# EAGLE design avr-usb-i2c (EAGLE 5.06)
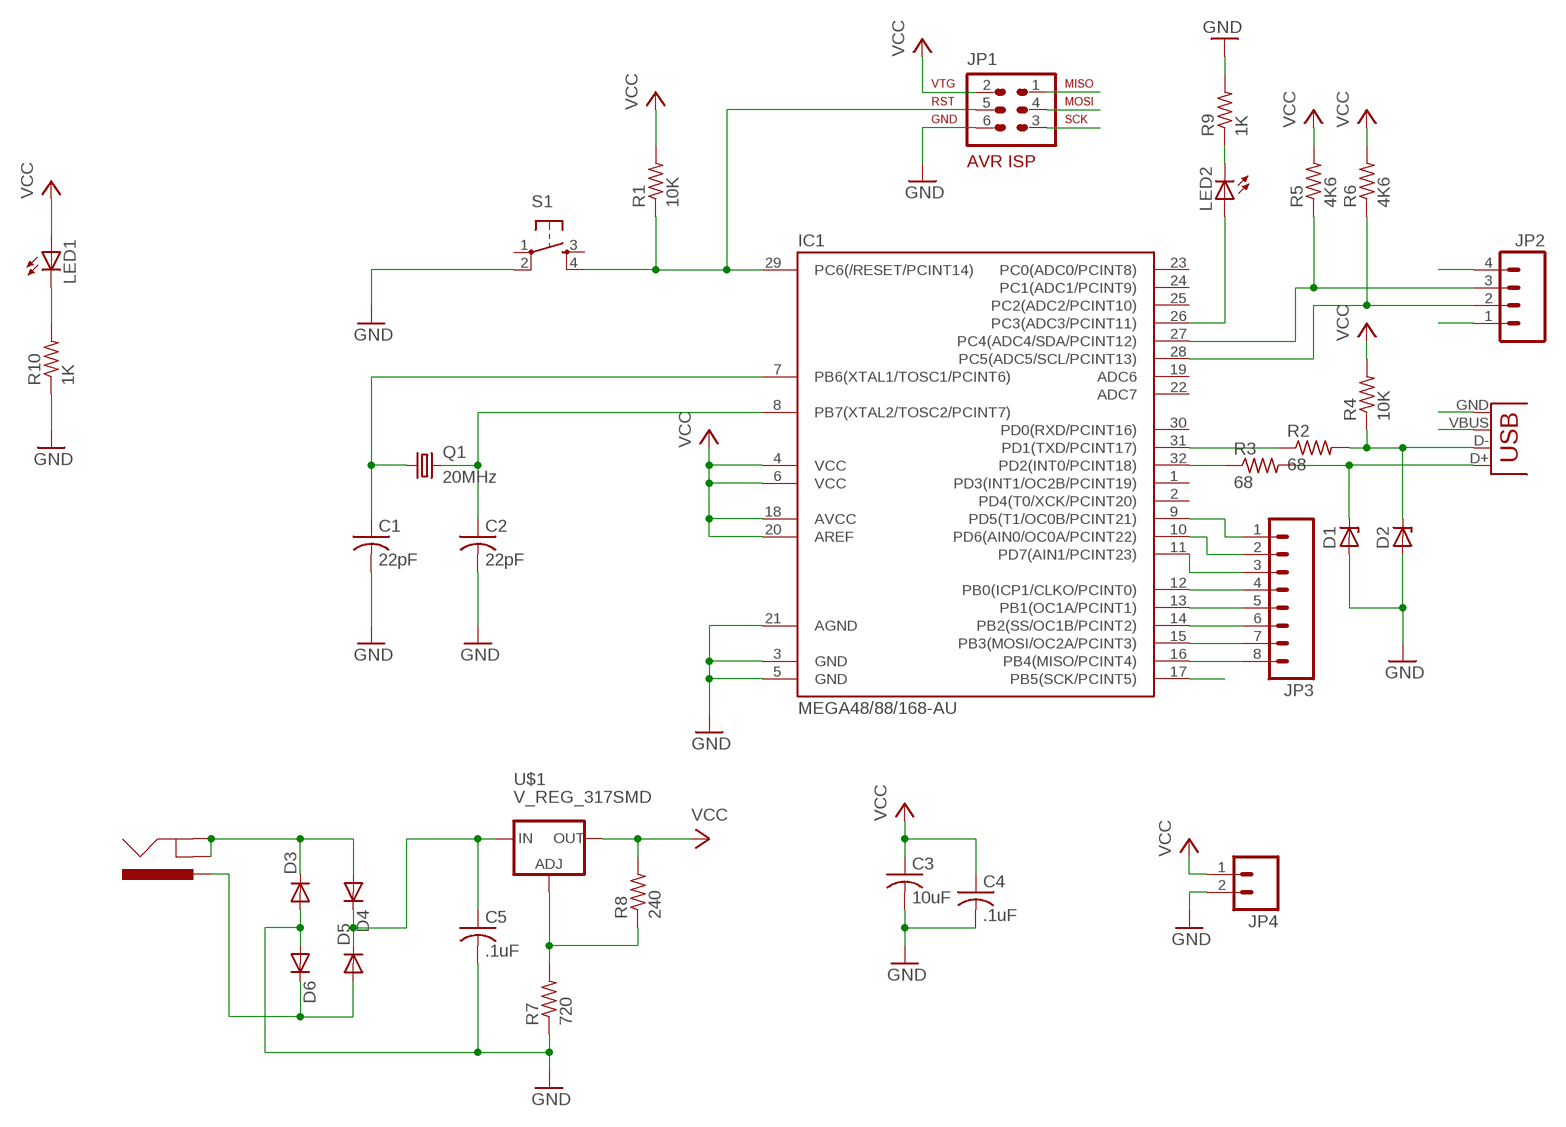
[diagram p0: schematic, sheet 1]

## Parts
C1  22pF  C-USC0805  [C0805]
C2  22pF  C-USC0805  [C0805]
C3  10uF  C-USC1206  [C1206]
C4  .1uF  C-USC0805  [C0805]
C5  .1uF  C-USC0805  [C0805]
D1  ZENER-DIODESOT23  [SOT23]
D2  ZENER-DIODESOT23  [SOT23]
D3  DIODESMA  [SMA-DIODE]
D4  DIODESMA  [SMA-DIODE]
D5  DIODESMA  [SMA-DIODE]
D6  DIODESMA  [SMA-DIODE]
IC1  MEGA48/88/168-AU  [TQFP32-08]
J1  POWER_JACKPTH  [POWER_JACK_PTH]
JP1  AVR-ISP-6  [AVR-ISP-6]
JP2  M04PTH  [1X04]
JP3  M08  [1X08]
JP4  M02PTH  [1X02]
LED1  LED1206  [LED-1206]
LED2  LED1206  [LED-1206]
Q1  20MHz  CRYSTAL5X3  [CRYSTAL-SMD-5X3]
R1  10K  R-US_M1206  [M1206]
R2  68  R-US_M1206  [M1206]
R3  68  R-US_M1206  [M1206]
R4  10K  R-US_M1206  [M1206]
R5  4K6  R-US_M1206  [M1206]
R6  4K6  R-US_M1206  [M1206]
R7  720  R-US_M1206  [M1206]
R8  240  R-US_M1206  [M1206]
R9  1K  R-US_M1206  [M1206]
R10  1K  R-US_M1206  [M1206]
S1  TAC_SWITCHPTH  [TACTILE-PTH]
U$1  V_REG_317SMD  [SOT223]
X1  USBSMD  [USB-MINIB]

## Nets
GND [GND]: C1.2 C2.2 C3.2 C4.2 C5.2 D1.1(A) D2.1(A) D3.A D6.A IC1.3(GND) IC1.5(GND) IC1.21(AGND) JP1.6 JP2.4 JP4.2 R7.1 R9.2 R10.1 S1.2 X1.GND
MISO: IC1.16(PB4(MISO/PCINT4)) JP1.1 JP3.8
MOSI: IC1.15(PB3(MOSI/OC2A/PCINT3)) JP1.4 JP3.7
N$1: C1.1 IC1.7(PB6(XTAL1/TOSC1/PCINT6)) Q1.1
N$2: C2.1 IC1.8(PB7(XTAL2/TOSC2/PCINT7)) Q1.3
N$3: IC1.29(PC6(/RESET/PCINT14)) JP1.5 R1.1 S1.4
N$4: IC1.31(PD1(TXD/PCINT17)) R2.1
N$5: IC1.32(PD2(INT0/PCINT18)) R3.1
N$6: IC1.27(PC4(ADC4/SDA/PCINT12)) JP2.3 R5.1
N$7: IC1.28(PC5(ADC5/SCL/PCINT13)) JP2.2 R6.1
N$8: IC1.26(PC3(ADC3/PCINT11)) LED2.A
N$9: LED2.C R9.1
N$10: D1.3(C) R3.2 X1.D+
N$11: D2.3(C) R2.2 R4.1 X1.D-
N$12: R7.2 R8.1 U$1.1(ADJ)
N$13: LED1.C R10.2
N$14 [VCC]: D3.C D4.A J1.GND J1.GNDBREAK
N$15: C5.1 D4.C D5.C U$1.3(IN)
N$16 [GND]: D5.A D6.C J1.PWR
N$17: IC1.14(PB2(SS/OC1B/PCINT2)) JP3.6
N$18: IC1.12(PB0(ICP1/CLKO/PCINT0)) JP3.4
N$19: IC1.11(PD7(AIN1/PCINT23)) JP3.3
N$20: IC1.10(PD6(AIN0/OC0A/PCINT22)) JP3.2
N$21: IC1.9(PD5(T1/OC0B/PCINT21)) JP3.1
N$22: IC1.13(PB1(OC1A/PCINT1)) JP3.5
SCK: IC1.17(PB5(SCK/PCINT5)) JP1.3
VCC [VCC]: C3.1 C4.1 IC1.4(VCC) IC1.6(VCC) IC1.18(AVCC) IC1.20(AREF) JP1.2 JP2.1 JP4.1 LED1.A R1.2 R4.2 R5.2 R6.2 R8.2 U$1.2(OUT) X1.VBUS
Unconnected: IC1.1(PD3(INT1/OC2B/PCINT19)) IC1.2(PD4(T0/XCK/PCINT20)) IC1.19(ADC6) IC1.22(ADC7) IC1.23(PC0(ADC0/PCINT8)) IC1.24(PC1(ADC1/PCINT9)) IC1.25(PC2(ADC2/PCINT10)) IC1.30(PD0(RXD/PCINT16)) S1.1 S1.3

## Library data of the parts
C1-C5 = rcl:C-US: CAPACITOR, American symbol
D1 D2 = diode:ZENER-DIODE: Z-Diode
D3-D6 = SparkFun:DIODE: Diode These are standard reverse protection diodes and small signal diodes. SMA package can handle up to about 1A. SOD-323 can handle about 200mA. What the SOD-323 package when ordering, there are some mfgs out there that are 5-pin packages.
IC1 = avr-6:MEGA48/88/168
J1 = SparkFun:POWER_JACK: Power Jack This is the standard 5.5mm barrel jack for power. The PTH is the most common, proven, reliable, footprint. All others are experimental. The Slot footprint only works if the mill layer is transmitted to the PCB fab house so be warned. Spark Fun Electronics SKU : PRT-00119. Mating wall wart : TOL-00298 (and others)
JP1 = avr-6:AVR-ISP-6: AVR ISP-6 Serial Programming Header
JP2 = SparkFun:M04: Header 4 Standard 4-pin 0.1" header. Use with straight break away headers (SKU : PRT-00116), right angle break away headers (PRT-00553), swiss pins (PRT-00743), machine pins (PRT-00117), and female headers (PRT-00115). Molex polarized connector foot print use with SKU : PRT-08231 with associated crimp pins and housings.
JP3 = SparkFun:M08: Header 8 Standard 8-pin 0.1" header. Use with straight break away headers (SKU : PRT-00116), right angle break away headers (PRT-00553), swiss pins (PRT-00743), machine pins (PRT-00117), and female headers (PRT-00115).
JP4 = SparkFun:M02: Header 2 Standard 2-pin 0.1" header. Use with straight break away headers (SKU : PRT-00116), right angle break away headers (PRT-00553), swiss pins (PRT-00743), machine pins (PRT-00117), and female headers (PRT-00115). Molex polarized connector foot print use with SKU : PRT-08233 with associated crimp pins and housings.
LED1 LED2 = SparkFun:LED: LEDs Standard schematic elements and footprints for 5mm, 3mm, 1206, and 0603 sized LEDs. 5mm - Spark Fun Electronics SKU : COM-00529 (and others)
Q1 = SparkFun:CRYSTAL: Crystals Various standard crystals. Proven footprints. Spark Fun Electronics SKU : COM-00534
R1-R10 = rcl:R-US_: RESISTOR, American symbol
S1 = SparkFun:TAC_SWITCH: Momentary Switch Button commonly used for reset or general input. Spark Fun Electronics SKU : COM-00097
U$1 = SparkFun:V_REG_317: Voltage Regulator Standard LM317 adjustable voltage regulator. AOI (Adjust Output Input). Google 'LM317 Calculator' for easy to use app to get the two resistor values needed. 240/720 for 5V output. 240/390 for 3.3V output. Spark Fun Electronics SKU : COM-00527
X1 = SparkFun:USB: USB Connectors USB-B-PTH is fully proven SKU : PRT-00139 USB-miniB is fully proven SKU : PRT-00587 USB-A-PCB is untested. USB-A-H is throughly reviewed, but untested. Spark Fun Electronics SKU : PRT-00437 USB-B-SMT is throughly reviewed, but untested. Needs silkscreen touching up. USB-A-S has not been used/tested USB-MB-H has not been used/tested

## Net classes
1 VCC: width 0.305 mm
2 GND: width 0.305 mm

## Board
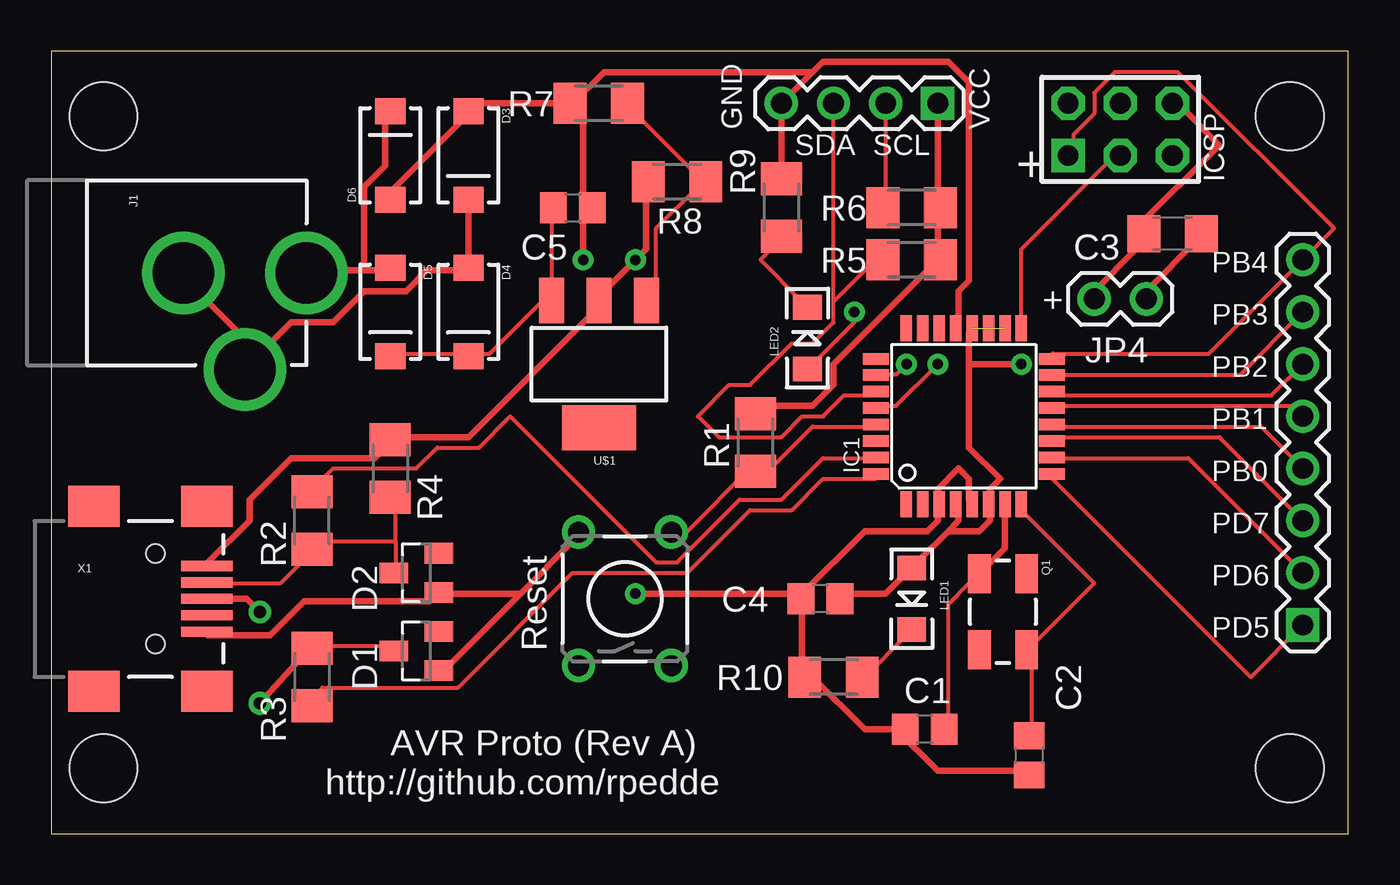
[diagram p1: board, top side]
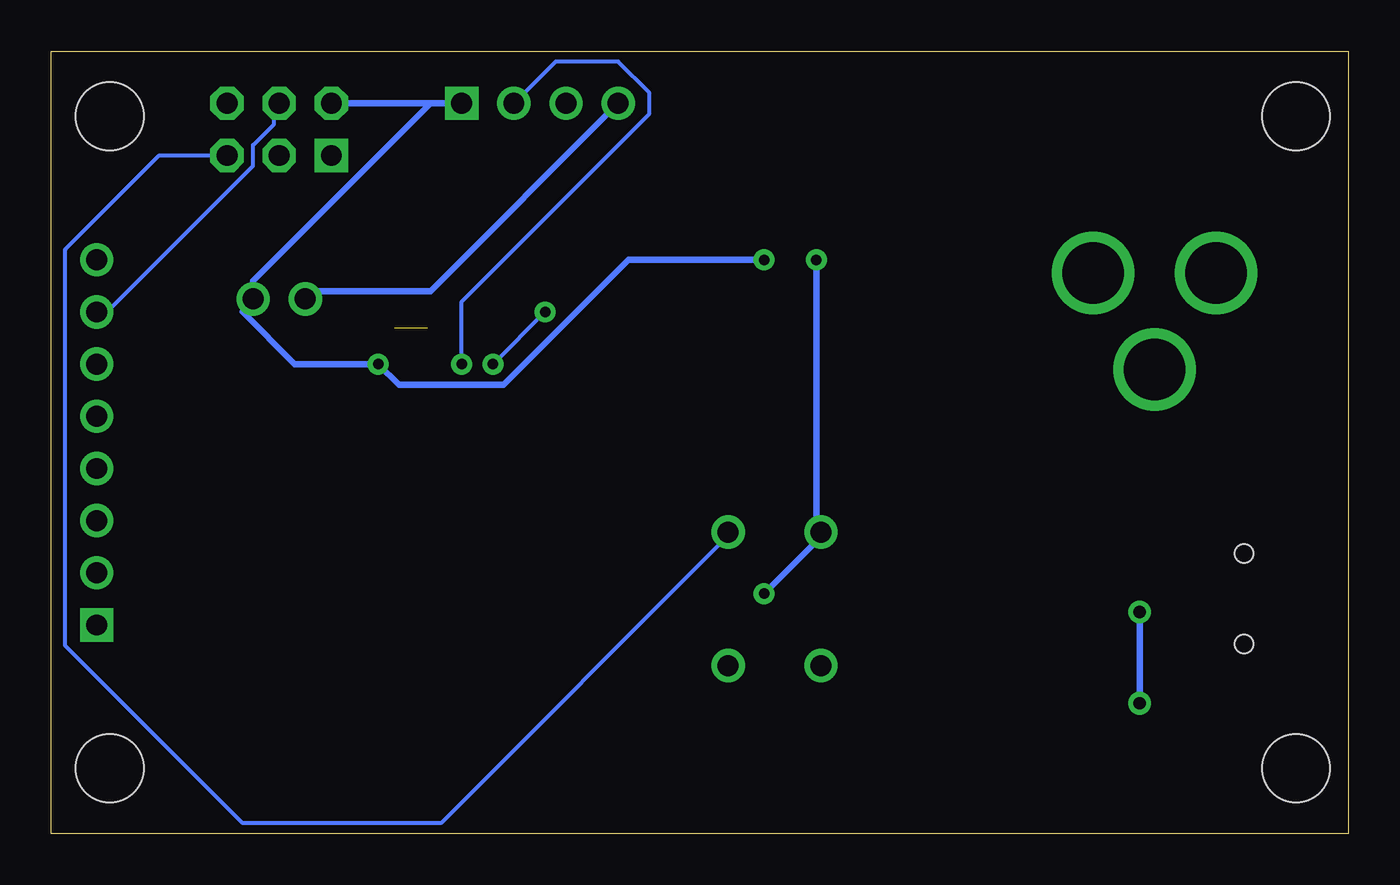
[diagram p2: board, bottom side, seen from below]

Size 63.17 x 38.09 mm. Coordinates in mm from the lower left corner, seen from the top.
Outline: 0,0 63.17,0 63.17,38.09 0,38.09 0,0
Copper layers (1*16): Top 0.035mm / dielectric 1.5mm / Bottom 0.035mm
Design rules "SparkFun": minimum track width 8mil, minimum drill 20mil, track to track 8mil, track to pad 8mil, pad to pad 8mil, via to via 8mil, smd to smd 8mil, copper to edge 10mil, drill to drill 8mil, minimum pad ring 12mil, minimum via ring 10mil, stop-mask expansion 4mil, vias tented up to drill 25mil, thermal gap 10mil

### Footprints (pad centres in the part's own frame; a part is rotated, then mirrored left to right if it is on the bottom)
C0805 = smd 1.3 x 1.5: 1 -0.95,0; 2 0.95,0
C1206 = smd 1.6 x 1.8: 1 -1.4,0; 2 1.4,0
SOT23 = smd 1 x 1.4: 1 -0.95,-1.1; 2 0.95,-1.1; 3 0,1.1
SMA-DIODE = smd 1.27 x 1.47: A -2.15,0; C 2.15,0
TQFP32-08 = smd 1.27 x 0.559: 1 -4.293,2.8; 2 -4.293,2; 3 -4.293,1.2; 4 -4.293,0.4; 5 -4.293,-0.4; 6 -4.293,-1.2; 7 -4.293,-2; 8 -4.293,-2.8; 17 4.293,-2.8; 18 4.293,-2; 19 4.293,-1.2; 20 4.293,-0.4; 21 4.293,0.4; 22 4.293,1.2; 23 4.293,2; 24 4.293,2.8 | smd 0.559 x 1.27: 9 -2.8,-4.293; 10 -2,-4.293; 11 -1.2,-4.293; 12 -0.4,-4.293; 13 0.4,-4.293; 14 1.2,-4.293; 15 2,-4.293; 16 2.8,-4.293; 25 2.8,4.293; 26 2,4.293; 27 1.2,4.293; 28 0.4,4.293; 29 -0.4,4.293; 30 -1.2,4.293; 31 -2,4.293; 32 -2.8,4.293
POWER_JACK_PTH = drill 2.997 round: GND 0,7.7; GNDBREAK 4.7,10.7; PWR 0,13.7
AVR-ISP-6 = drill 1.016 square: 1 -2.54,-1.27 | drill 1.016 octagon: 2 -2.54,1.27; 3 0,-1.27; 4 0,1.27; 5 2.54,-1.27; 6 2.54,1.27
1X04 = drill 1.016 square: 1 0,0 | drill 1.016 round: 2 2.54,0; 3 5.08,0; 4 7.62,0
1X08 = drill 1.016 square: 1 0,0 | drill 1.016 round: 2 2.54,0; 3 5.08,0; 4 7.62,0; 5 10.16,0; 6 12.7,0; 7 15.24,0; 8 17.78,0
1X02 = drill 1.016 round: 1 0,0; 2 2.54,0
LED-1206 = smd 1.2 x 1.4: A -1.5,0; C 1.5,0
CRYSTAL-SMD-5X3 = smd 1.9 x 1.1: 1 -1.85,-1.15; 2 1.85,-1.15; 3 1.85,1.15; 4 -1.85,1.15
M1206 = smd 1.6 x 2: 1 -1.4,0; 2 1.4,0
TACTILE-PTH = drill 1.016 round: 1 -3.251,2.261; 2 3.251,2.261; 3 -3.251,-2.261; 4 3.251,-2.261
SOT223 = smd 1.219 x 2.235: 1 -2.311,-3.099; 2 0,-3.099; 3 2.311,-3.099 | smd 3.6 x 2.2: 4 0,3.099
STAND-OFF = hole 3.302: 0,0
USB-MINIB = smd 2.5 x 0.5: D+ 2.5,0; D- 2.5,0.8; GND 2.5,-1.6; ID 2.5,-0.8; VBUS 2.5,1.6 | smd 2.5 x 2: GND@1 -3,-4.5; GND@2 -3,4.5; GND@3 2.5,4.5; GND@4 2.5,-4.5 | hole 0.9: 0,2.2; 0,-2.2

### Placement (x,y rotation side)
C1  42.55,5.08 180 top
C2  47.62,3.81 270 top
C3  54.61,29.21 180 top
C4  37.47,11.43 180 top
C5  25.4,30.48 0 top
D1  17.78,8.89 90 top
D2  17.78,12.7 90 top
D3  20.32,33.02 270 top
D4  20.32,25.4 270 top
D5  16.51,25.4 270 top
D6  16.51,33.02 90 top
IC1  44.45,20.32 90 top
J1  -1.27,27.3 270 top
JP1  52.07,34.29 0 top
JP2  43.18,35.56 180 top
JP3  60.96,10.16 90 top
JP4  53.34,26.04 180 top
LED1  41.91,11.43 270 top
LED2  36.83,24.13 90 top
Q1  46.35,10.79 270 top
R1  34.29,19.05 90 top
R2  12.7,15.24 270 top
R3  12.7,7.62 90 top
R4  16.51,17.78 90 top
R5  41.91,27.94 0 top
R6  41.91,30.48 0 top
R7  26.67,35.56 0 top
R8  30.48,31.75 180 top
R9  35.56,30.48 90 top
R10  38.1,7.62 0 top
S1  27.94,11.43 90 top
U$1  26.67,22.86 180 top
U$2  [STAND-OFF]  2.54,34.92 0 top
U$3  [STAND-OFF]  2.54,3.17 0 top
U$4  [STAND-OFF]  60.33,3.17 0 top
U$5  [STAND-OFF]  60.33,34.92 0 top
X1  5.08,11.43 0 top

### Tracks (layer width: path | path; a pad name or v marks a point on that pad's centre or on a via)
GND  (via drill 0.51)
  Top 0.305: JP4.2 50.8,26.42 52.83,28.45 52.83,28.96 C3.2 52.83,29.46 56.9,33.53 54.86,35.56 JP1.6 | 25.91,30.48 25.91,35.05 25.4,35.56 | D6.A 16.76,30.99 16.76,31.5 20.32,35.05 D3.A 20.32,35.56 R7.1 25.4,35.56 | 37.08,37.08 JP2.4 R9.2 | 37.08,37.08 37.59,37.59 43.69,37.59 44.7,36.58 44.7,26.92 44.2,26.42 44.2,24.89 IC1.21 | 25.4,35.56 26.92,37.08 37.08,37.08 | C4.2 36.58,11.68 39.62,14.73 42.67,14.73 43.18,15.24 43.18,15.75 IC1.3 43.18,16.26 43.18,16.76 44.2,17.78 44.7,17.27 44.7,16.26 IC1.5 | 41.15,5.08 39.62,5.08 37.08,7.62 R10.1 36.58,7.62 36.58,11.18 C4.2 | 41.15,5.08 43.18,3.05 47.24,3.05 C2.2 | 41.15,5.08 C1.2 | 22.86,11.68 25.4,14.22 S1.2 | 22.86,11.68 19.3,8.13 D1.1 | 22.86,11.68 19.3,11.68 D2.1 18.8,11.68 18.41,11.3 12.32,11.3 10.67,9.65 7.62,9.65 X1.GND | v28.45,11.68 36.07,11.68 C4.2 | v25.91,27.94 25.91,30.48 | 25.91,30.48 C5.2
  Bottom 0.305: JP2.4 44.7,26.42 50.8,26.42 JP4.2 | v28.45,11.68 25.91,14.22 S1.2 25.91,14.73 v25.91,27.94
MISO
  Top 0.203: IC1.16 48.77,23.37 56.39,23.37 JP3.8 62.48,29.46 54.86,37.08 51.82,37.08 50.8,36.07 50.8,35.05 49.78,34.04 49.78,33.02 JP1.1
MOSI
  Top 0.203: JP3.7 57.91,22.35 48.77,22.35 IC1.15
  Bottom 0.203: JP3.7 60.45,25.4 53.34,32.51 53.34,33.53 52.32,34.54 52.32,35.56 JP1.4
N$1
  Top 0.203: C1.1 43.69,5.08 43.69,11.18 44.7,12.19 Q1.1
  Top 0.305: Q1.1 46.45,13.89 IC1.7
N$2
  Top 0.203: IC1.8 47.24,15.75 50.8,12.19 47.75,9.14 Q1.3 47.75,8.64 47.75,5.08 C2.1
N$3
  Top 0.203: IC1.29 40.13,19.81 37.08,19.81 34.54,17.27 R1.1 34.04,17.78 30.99,14.73 30.48,14.73 S1.4
  Bottom 0.203: JP1.5 57.91,33.02 62.48,28.45 62.48,9.14 53.85,0.51 44.2,0.51 30.48,14.22 S1.4
N$4
  Top 0.203: IC1.31 40.13,18.29 37.59,18.29 35.56,16.26 33.53,16.26 30.48,13.21 29.46,13.21 22.35,20.32 20.83,18.8 18.8,18.8 17.78,17.78 13.72,17.78 12.7,16.76 R2.1
N$5
  Top 0.203: IC1.32 40.13,17.27 37.59,17.27 36.07,15.75 34.04,15.75 30.99,12.7 25.4,12.7 19.81,7.11 13.21,7.11 12.7,6.6 R3.1
N$6
  Top 0.203: 38.1,25.91 38.1,24.89 37.08,23.88 36.07,23.88 34.04,21.84 33.02,21.84 31.5,20.32 32.51,19.3 35.56,19.3 36.58,20.32 37.59,20.32 38.61,21.34 40.13,21.34 IC1.27 | 38.1,25.91 40.13,27.94 R5.1 | 38.1,25.91 JP2.3
N$7  (via drill 0.51)
  Top 0.203: v43.18,22.86 41.15,20.83 40.64,20.83 IC1.28 | JP2.2 40.64,30.48 R6.1
  Bottom 0.203: v43.18,22.86 43.18,25.91 34.04,35.05 34.04,36.07 35.56,37.59 38.61,37.59 JP2.2
N$8  (via drill 0.51)
  Top 0.203: v41.66,22.86 41.15,22.35 40.64,22.35 IC1.26 | v39.12,25.4 39.12,24.89 37.08,22.86 LED2.A
  Bottom 0.203: v39.12,25.4 v41.66,22.86
N$9
  Top 0.203: LED2.C 36.58,25.91 34.54,27.94 35.56,28.96 R9.1
N$10  (via drill 0.6)
  Top 0.203: D1.3 16.26,9.14 12.7,9.14 R3.2
  Top 0.305: 12.7,9.14 v10.16,6.35 | v10.16,10.79 9.53,11.43 X1.D+
  Bottom 0.305: v10.16,6.35 v10.16,10.79
N$11
  Top 0.203: 16.76,14.22 16.76,16.26 R4.1 | 16.76,14.22 16.76,12.7 D2.3 | 16.76,14.22 12.7,14.22 R2.2 12.7,13.72 11.18,12.19 7.62,12.19 X1.D-
N$12
  Top 0.203: R7.2 27.94,35.56 31.5,32 R8.1 31.5,31.5 29.46,29.46 29.46,26.42 U$1.1
N$13
  Top 0.203: LED1.C 41.66,9.65 39.62,7.62 R10.2
N$14
  Top 0.305: D3.C D4.A 20.32,27.43 18.29,27.43 17.27,26.42 15.24,26.42 13.72,24.89 11.68,24.89 10.16,23.37 | 10.16,23.37 9.65,22.86 J1.GNDBREAK 10.16,23.37 | 10.16,23.37 6.6,26.92 J1.GND
N$15
  Top 0.203: 20.32,23.37 16.76,23.37 D5.C | C5.1 24.38,30.48 24.38,26.42 U$1.3 23.88,25.91 21.34,23.37 20.32,23.37 | 20.32,23.37 D4.C
N$16
  Top 0.305: 15.24,27.43 12.7,27.43 J1.PWR | 15.24,27.43 16.26,27.43 D5.A | 15.24,27.43 15.24,31.5 16.26,32.51 16.26,35.05 D6.C
N$17
  Top 0.203: JP3.6 59.44,21.34 48.77,21.34 IC1.14
N$18
  Top 0.203: JP3.4 58.93,19.81 48.77,19.81 IC1.12
N$19
  Top 0.203: JP3.3 56.9,19.3 48.77,19.3 IC1.11
N$20
  Top 0.203: JP3.2 55.37,18.29 48.77,18.29 IC1.10
N$21
  Top 0.203: JP3.1 58.42,7.62 48.77,17.27 IC1.9
N$22
  Top 0.203: JP3.5 60.45,20.83 48.77,20.83 IC1.13
SCK
  Top 0.203: IC1.17 47.24,24.89 47.24,28.45 51.82,33.02 JP1.3
VCC  (via drill 0.51)  (1 unrouted)
  Top 0.305: R8.2 28.96,31.5 28.96,28.45 v28.45,27.94 26.92,26.42 U$1.2 26.92,25.91 20.32,19.3 16.76,19.3 R4.2 16.26,18.8 15.75,18.29 11.68,18.29 9.65,16.26 9.65,15.24 7.62,13.21 X1.VBUS | 43.69,14.73 42.16,13.21 LED1.A 41.66,12.7 40.64,11.68 38.61,11.68 C4.1 | 43.69,14.73 44.2,15.24 44.2,15.75 IC1.4 | 43.69,14.73 45.21,14.73 45.72,15.24 45.72,15.75 IC1.6 45.72,16.26 45.72,16.76 46.23,17.27 44.7,18.8 44.7,22.86 | 44.7,22.86 44.7,24.38 IC1.20 | C3.1 55.88,28.96 53.34,26.42 JP4.1 | 43.18,27.94 38.1,22.86 38.1,21.84 37.08,20.83 34.54,20.83 R1.2 | 43.18,30.48 43.18,27.94 | 43.18,27.94 R5.2 | JP2.1 43.18,30.48 | 43.18,30.48 R6.2 | v47.24,22.86 44.7,22.86
  Bottom 0.305: 44.7,35.56 JP2.1 | 44.7,35.56 JP1.2 | 44.7,35.56 53.34,26.92 JP4.1 53.34,25.91 53.85,25.4 51.31,22.86 v47.24,22.86 46.23,21.84 41.15,21.84 35.05,27.94 v28.45,27.94

### Text on the board
_tsilk: GND | VCC | SDA | SCL | + | ICSP | PB4 | + | PB3 | PB2 | PB1 | PB0 | PD7 | PD6 | PD5 | Reset | AVR Proto (Rev A) | http://github.com/rpedde